# Altium schematic sheet Battery_Manager.SchDoc
size A; SheetNumber: 3; SheetTotal: 4
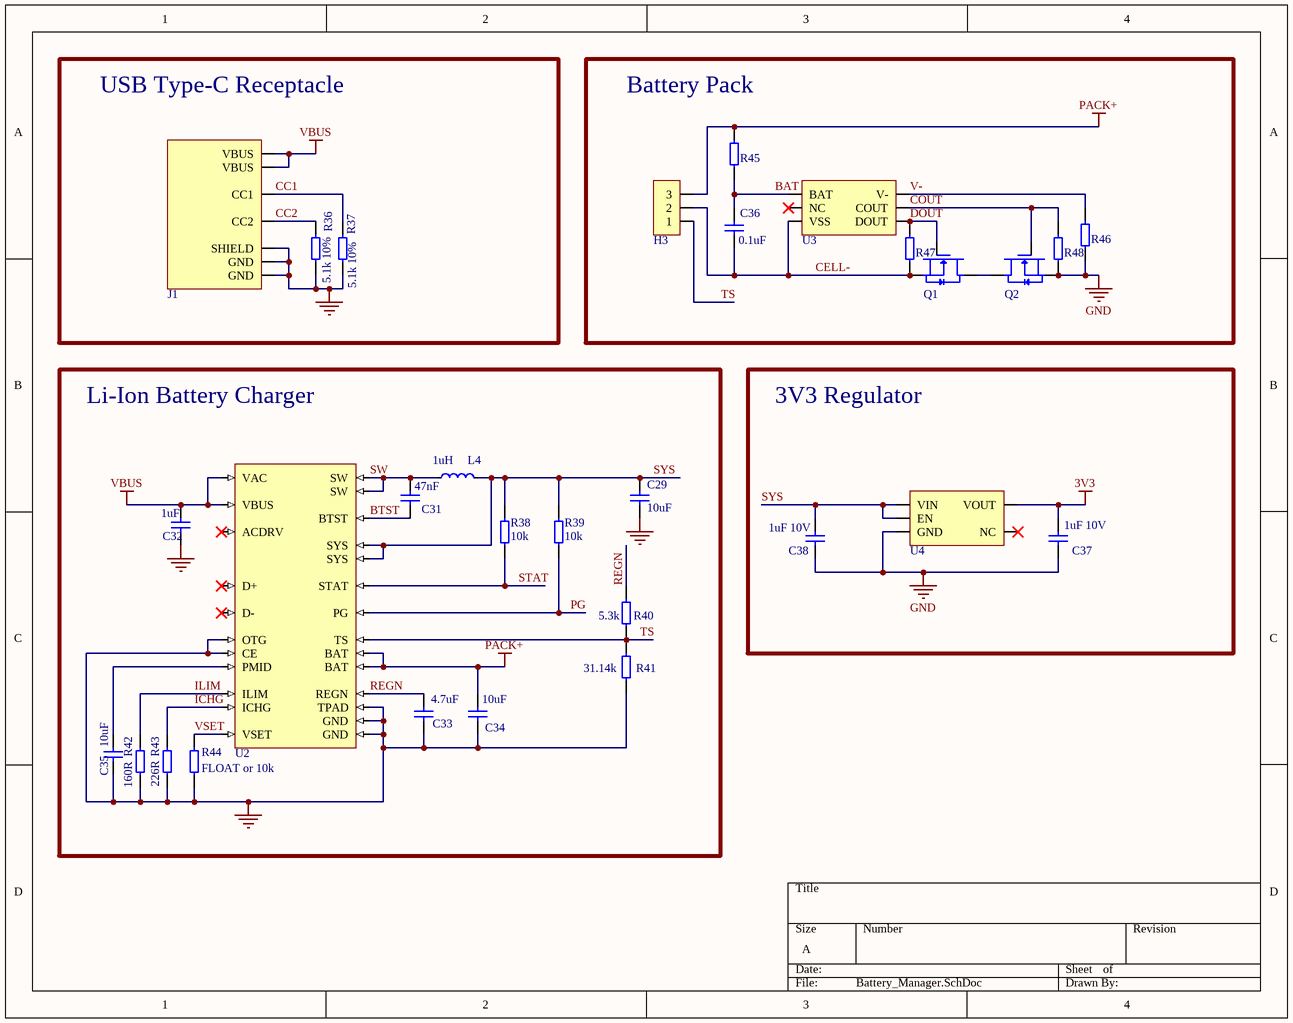
[diagram p0: Battery_Manager.SchDoc]

## Parts
C29  10uF  [0603 Capacitor]
C31  47nF  [0603 Capacitor]
C32  1uF  [0603 Capacitor]
C33  4.7uF  [0603 Capacitor]
C34  10uF  [0603 Capacitor]
C35  10uF  [0603 Capacitor]
C36  0.1uF  [0603 Capacitor]
C37  1uF 10V  [0603 Capacitor]
C38  1uF 10V  [0603 Capacitor]
H3  22-05-7035  [Molex Header 3]  (value not drawn)
J1  USB4125-GF-A  [USB4125]  (value not drawn)
L4  1uH  [SRP2510A]
Q1  CSD16406Q3  [CSD16406Q3]  (value not drawn)
Q2  CSD16406Q3  [CSD16406Q3]  (value not drawn)
R36  5.1k 10%  [0603 Resistor]
R37  5.1k 10%  [0603 Resistor]
R38  10k  [0603 Resistor]
R39  10k  [0603 Resistor]
R40  5.3k  [0603 Resistor]
R41  31.14k  [0603 Resistor]
R42  160R  [0603 Resistor]
R43  226R  [0603 Resistor]
R44  FLOAT or 10k  [0603 Resistor]
R45  330R  [0603 Resistor]  (value not drawn)
R46  2.2k  [0603 Resistor]  (value not drawn)
R47  5M  [0603 Resistor]  (value not drawn)
R48  5M  [0603 Resistor]  (value not drawn)
U2  BQ25616JRTWR  [BQ25616]  (value not drawn)
U3  BQ29700DSET  [BQ297xx]  (value not drawn)
U4  MIC5504-3.3YM5-TR  [MIC5504]  (value not drawn)

## Blocks framed on the sheet
USB Type-C Receptacle: J1 R36 R37
Battery Pack: C36 H3 Q1 Q2 R45-R48 U3
Li-Ion Battery Charger: C29 C31-C35 L4 R38-R44 U2
3V3 Regulator: C37 C38 U4

## Nets
3V3: C37.2 U4.5(VOUT)
GND: C29.1 C32.1 C33.1 C34.1 C35.1 C37.1 C38.1 J1.A12(GND) J1.B12(GND) J1.SHIELD Q2.1 R36.1 R37.1 R41.1 R42.1 R43.1 R44.1 R46.1 R48.1 U2.6(OTG) U2.9(CE) U2.17(GND) U2.18(GND) U2.25(TPAD) U4.2(GND)
PACK+: C34.2 H3.3 R45.2 U2.13(BAT) U2.14(BAT)
VBUS: C32.2 J1.A9(VBUS) J1.B9(VBUS) U2.1(VAC) U2.24(VBUS)
BAT: C36.2 R45.1 U3.5(BAT)
BTST: C31.1 U2.21(BTST)
CC1: J1.A5(CC1) R37.2
CC2: J1.B5(CC2) R36.2
CELL-: C36.1 H3.2 Q1.1 R47.1 U3.4(VSS)
COUT: Q2.4 R48.2 U3.2(COUT)
DOUT: Q1.4 R47.2 U3.3(DOUT)
ICHG: R43.2 U2.10(ICHG)
ILIM: R42.2 U2.8(ILIM)
PG: R39.1 U2.7(PG)
REGN: C33.2 R40.2 U2.22(REGN)
STAT: R38.1 U2.5(STAT)
SW: C31.2 L4.1 U2.19(SW) U2.20(SW)
SYS: C29.2 C38.2 L4.2 R38.2 R39.2 U2.15(SYS) U2.16(SYS) U4.1(VIN) U4.3(EN)
TS: H3.1 R40.1 R41.2 U2.11(TS)
V-: R46.2 U3.6(V-)
VSET: R44.2 U2.12(VSET)
NetC35_2: C35.2 U2.23(PMID)
NetQ1_5: Q1.5 Q2.5

Not connected (* = marked no-connect by the designer): U2 2(ACDRV)* 3(D+)* 4(D-)*; U3 1(NC)*; U4 4(NC)*

## Library data of the parts
C29 C31-C38 = Capacitor
H3 = 22-05-7035: Header 2.5mm SPOX,  WTB,  RA,  F/lock,  3w; Manufacturer 1: Molex; Voltage Rating: 250V; Current Rating: 3A; Gender: Male; Contact Resistance: 20mR; Number of Positions: 3; Max Voltage Rating (DC): 250.25kV; Insulation Resistance: 1GR; Shrouded: Yes (With); Test Voltage: 1kV; Glow Wire Compliant: Non-compliant; Supplier 1: Digi-Key; Supplier Part Number 1: WM18901-ND; Manufacturer Part Number 1: 22-05-7035; RoHS: Yes; Category: Headers and Wire Housings; Stock 1: 4209; Pricing 1: 1=0.26000, 10=0.20600, 100=0.14770, 1000=0.11562, 5000=0.10278, 10000=0.09314 (USD); Mount: Through Hole; Contact Plating: Tin,Copper; Contact Material: Brass; Housing Color: Natural; Color: Natural; Housing Material: Nylon; Contact Shape: Circular; Contact Finish - Mating: TIN; Insulation Material: Nylon; Insulation Color: Natural; Min Operating Temperature: -40°C; Max Operating Temperature: 105°C; Package Quantity: 20000; Packaging: Bulk; Termination: Solder; Number of Rows: 1; Number of Contacts: 3; Orientation: Right Angle; Voltage Rating (DC): 250V; Number of Circuits: 3; Contact Gender: Male; Connector Type: Header; Max Voltage Rating (AC): 250V; Number of Poles: 3; Max Current Rating: 3A; Fastening Type: Detent; Series: Mini-SPOX 5268; Contact Type: Male Pin; Length: 9.9mm; Height: 4.9mm; Pitch: 2.5mm; Depth: 7.9mm; Radiation Hardening: No; REACH SVHC: Unknown; Lead Free: Lead Free; RoHS Compliant: Yes; Flammability Rating: UL94 V-0; ComponentLink1URL: https://datasheet.ciiva.com/30128/225440022057035-pcb-headers-30128301.pdf?src-supplier=Onlinecomponents.com; ComponentLink1Description: https://datasheet.ciiva.com/30128/225440022057035-pcb-headers-30128301.pdf?src-supplier=Onlinecomponents.com; ComponentLink2URL: https://datasheet.ciiva.com/11746/0900766b80da772d-11746287.pdf?src-supplier=RSComponents; ComponentLink2Description: https://datasheet.ciiva.com/11746/0900766b80da772d-11746287.pdf?src-supplier=RSComponents; ComponentLink3URL: https://datasheet.ciiva.com/5153/0022057035-pcb-headers-158546-5153221.pdf?src-supplier=Mouser; ComponentLink3Description: https://datasheet.ciiva.com/5153/0022057035-pcb-headers-158546-5153221.pdf?src-supplier=Mouser; ComponentLink4URL: https://datasheet.ciiva.com/19461/1965939-19461711.pdf?src-supplier=Jameco; ComponentLink4Description: https://datasheet.ciiva.com/19461/1965939-19461711.pdf?src-supplier=Jameco; ComponentLink5URL: https://datasheet.ciiva.com/7167/1869086-7167685.pdf?src-supplier=Newark; ComponentLink5Description: https://datasheet.ciiva.com/7167/1869086-7167685.pdf?src-supplier=Newark
J1 = USB4125-GF-A: Conn Rcp USB2.0 Typ C 24P SMD Ra; Manufacturer 1: GCT; Supplier 1: Digi-Key; Supplier Part Number 1: 2073-USB4125-GF-ACT-ND; Manufacturer Part Number 1: USB4125-GF-A
L4 = SRP2510A-1R0M: BOURNS - SRP2510A-1R0M - INDUCTOR, 1UH, 3A, 20%, SHIELDED; Core Material: Ferrite; Saturation Current: 3.5A; DC Resistance (DCR): 54mR; Self Resonant Frequency: 94MHz; Test Frequency: 1MHz; Supplier 1: Digi-Key; Supplier Part Number 1: SRP2510A-1R0MCT-ND; Manufacturer 1: Bourns; Manufacturer Part Number 1: SRP2510A-1R0M; RoHS: Yes; Category: Fixed Inductors; Stock 1: 5280; Pricing 1: 1=0.53000, 10=0.46200, 25=0.42880, 50=0.36300, 100=0.33000, 250=0.31020, 500=0.27720, 1000=0.22440 (USD); Mount: Surface Mount; Case/Package: 1008; Case Code (Imperial): 1008; Case Code (Metric): 2520; Min Operating Temperature: -40°C; Max Operating Temperature: 125°C; Resistor Type: Wirewound; Packaging: Cut Tape; Inductance: 1uH; Tolerance: 20%; Current Rating: 3A; Shielding: Shielded; Ratings: AEC-Q200; RoHS Compliant: Yes; ComponentLink1URL: http://www.farnell.com/datasheets/2330876.pdf?src-supplier=Farnell; ComponentLink1Description: http://www.farnell.com/datasheets/2330876.pdf?src-supplier=Farnell; ComponentLink2URL: http://www.farnell.com/datasheets/2330876.pdf?src-supplier=Newark; ComponentLink2Description: http://www.farnell.com/datasheets/2330876.pdf?src-supplier=Newark; ComponentLink3URL: https://www.bourns.com/docs/Product-Datasheets/srp2510a.pdf?src-supplier=Digi-Key; ComponentLink3Description: https://www.bourns.com/docs/Product-Datasheets/srp2510a.pdf?src-supplier=Digi-Key
Q1 Q2 = CSD16406Q3: TEXAS INSTRUMENTS - CSD16406Q3 - N CHANNEL MOSFET, 25V, 60A, SON; Rise Time: 12.9ns; Rds On Max: 5.3mR; Input Capacitance: 1.1nF; Nominal Vgs: 1.7V; Max Power Dissipation: 2.7W; Fall Time: 4.8ns; Turn-Off Delay Time: 8.5ns; Gate to Source Voltage (Vgs): 16V; Turn-On Delay Time: 7.3ns; Number of Elements: 1; Element Configuration: Single; Polarity: N-CHANNEL; Supplier 1: Digi-Key; Supplier Part Number 1: 296-24251-1-ND; Manufacturer 1: Texas Instruments; Manufacturer Part Number 1: CSD16406Q3; RoHS: Yes; Category: MOSFETs; Stock 1: 13974; Pricing 1: 1=1.17000, 10=0.95900, 25=0.94160, 100=0.74610, 500=0.63244, 1000=0.51518 (USD); Mount: Surface Mount; Case/Package: SON; Number of Pins: 8; Contact Plating: Tin,Matte; Min Operating Temperature: -55°C; Max Operating Temperature: 150°C; Packaging: Tape and Reel; Package Quantity: 1; Dual Supply Voltage: 25V; Drain to Source Voltage (Vdss): 25V; Continuous Drain Current (ID): 60A; Drain to Source Breakdown Voltage: 25V; Power Dissipation: 2.7W; Termination: SMD/SMT; Threshold Voltage: 1.7V; Series: NexFET™; Radiation Hardening: No; REACH SVHC: No SVHC; Lead Free: Contains Lead; RoHS Compliant: Yes; ComponentLink1URL: https://datasheet.ciiva.com/14192/slps202a-14192882.pdf?src-supplier=Avnet; ComponentLink1Description: https://datasheet.ciiva.com/14192/slps202a-14192882.pdf?src-supplier=Avnet; ComponentLink2URL: https://datasheet.ciiva.com/6387/csd16406q3-6387192.pdf?src-supplier=Digi-Key; ComponentLink2Description: https://datasheet.ciiva.com/6387/csd16406q3-6387192.pdf?src-supplier=Digi-Key; ComponentLink3URL: https://datasheet.ciiva.com/4438/slps202a-128073-4438442.pdf?src-supplier=Mouser; ComponentLink3Description: https://datasheet.ciiva.com/4438/slps202a-128073-4438442.pdf?src-supplier=Mouser; ComponentLink4URL: https://datasheet.ciiva.com/1255/csd16406q3-1255292.pdf?src-supplier=Newark; ComponentLink4Description: https://datasheet.ciiva.com/1255/csd16406q3-1255292.pdf?src-supplier=Newark; ComponentLink5URL: https://datasheet.ciiva.com/5832/483980-5832634.pdf?src-supplier=Farnell; ComponentLink5Description: https://datasheet.ciiva.com/5832/483980-5832634.pdf?src-supplier=Farnell; ComponentLink6URL: https://datasheet.ciiva.com/5832/483980-5832635.pdf?src-supplier=Farnell; ComponentLink6Description: https://datasheet.ciiva.com/5832/483980-5832635.pdf?src-supplier=Farnell; ComponentLink7URL: https://datasheet.ciiva.com/7643/1389665-7643292.pdf?src-supplier=Element14; ComponentLink7Description: https://datasheet.ciiva.com/7643/1389665-7643292.pdf?src-supplier=Element14; ComponentLink8URL: https://datasheet.ciiva.com/14423/slps202a-14423477.pdf?src-supplier=Avnet; ComponentLink8Description: https://datasheet.ciiva.com/14423/slps202a-14423477.pdf?src-supplier=Avnet; ComponentLink9URL: https://datasheet.ciiva.com/6387/csd16406q3-6387195.pdf?src-supplier=Digi-Key; ComponentLink9Description: https://datasheet.ciiva.com/6387/csd16406q3-6387195.pdf?src-supplier=Digi-Key; ComponentLink10URL: https://datasheet.ciiva.com/6387/csd16406q3-6387198.pdf?src-supplier=Digi-Key; ComponentLink10Description: https://datasheet.ciiva.com/6387/csd16406q3-6387198.pdf?src-supplier=Digi-Key
R36-R48 = Resistor
U2 = BQ25616JRTWR: Manufacturer 1: Texas Instruments; Supplier 1: Digi-Key; Supplier Part Number 1: 296-BQ25616JRTWRCT-ND; Manufacturer Part Number 1: BQ25616JRTWR; RoHS: Yes; Category: Battery Management; Stock 1: 553; Pricing 1: 1=3.10000, 10=2.78100, 25=2.62360, 100=2.23520, 250=2.09880, 500=1.83644, 1000=1.65330 (USD)
U3 = BQ29700DSET: Li-Ion/Li Polymer Advanced Single-Cell Battery Protector IC Family 6-WSON -40 to 85; Manufacturer 1: Texas Instruments; Number of Batteries: 1; Min Supply Voltage: 1.5V; Max Supply Voltage: 8V; Output Voltage: 28V; Output Current: 5.5uA; Operating Supply Current: 4uA; Fault Protection: Over Current,Short Circuit,Over/Under Voltage; Supplier 1: Digi-Key; Supplier Part Number 1: 296-37746-1-ND; Manufacturer Part Number 1: BQ29700DSET; RoHS: Yes; Category: Battery Management; Stock 1: 86; Pricing 1: 1=0.69000, 10=0.60500, 25=0.56840, 100=0.43090 (USD); Mount: Surface Mount; Case/Package: WFDFN; Number of Pins: 6; Weight: 0.000342oz; Contact Plating: Gold; Min Operating Temperature: -40°C; Max Operating Temperature: 85°C; Packaging: Tape and Reel; Number of Cells: 1; Max Output Voltage: 8V; Package Quantity: 250; Length: 1.55mm; Width: 1.55mm; Height: 0.8mm; Radiation Hardening: No; REACH SVHC: No SVHC; Lead Free: Lead Free; RoHS Compliant: Yes; ComponentLink1URL: https://datasheet.ciiva.com/46402/1817247-46402997.pdf?src-supplier=Element14; ComponentLink1Description: https://datasheet.ciiva.com/46402/1817247-46402997.pdf?src-supplier=Element14
U4 = MIC5504-3.3YM5-TR: MICROCHIP - MIC5504-3.3YM5-TR - LDO VOLT REG, 0.3A, 3.3V, SOT-23-5; Min Input Voltage: 2.5V; Max Input Voltage: 5.5V; Output Current: 300mA; Dropout Voltage: 380mV; Number of Outputs: 1; Quiescent Current: 38uA; Accuracy: 3%; Operating Supply Current: 42uA; Power Supply Rejection Ratio (PSRR): 60dB; Output Type: Fixed; Supplier 1: Digi-Key; Supplier Part Number 1: 576-4764-1-ND; Manufacturer 1: Microchip; Manufacturer Part Number 1: MIC5504-3.3YM5-TR; RoHS: Yes; Category: Voltage Regulators - Linear; Stock 1: 29072; Pricing 1: 1=0.13000, 25=0.09000 (USD); Mount: Surface Mount; Case/Package: SOT-23-5; Number of Pins: 5; Min Operating Temperature: -40°C; Max Operating Temperature: 125°C; Nominal Output Voltage: 3.3V; Packaging: Tape and Reel; Output Voltage: 3.3V; Max Output Current: 300mA; Length: 2.9mm; Width: 1.6mm; Height: 1.1mm; REACH SVHC: No SVHC; RoHS Compliant: No; ComponentLink1URL: https://datasheet.ciiva.com/46425/1856860-46425639.pdf?src-supplier=Element14; ComponentLink1Description: https://datasheet.ciiva.com/46425/1856860-46425639.pdf?src-supplier=Element14